# EAGLE schematic Electronics_Design_V2_v8 (EAGLE 9.7.0)
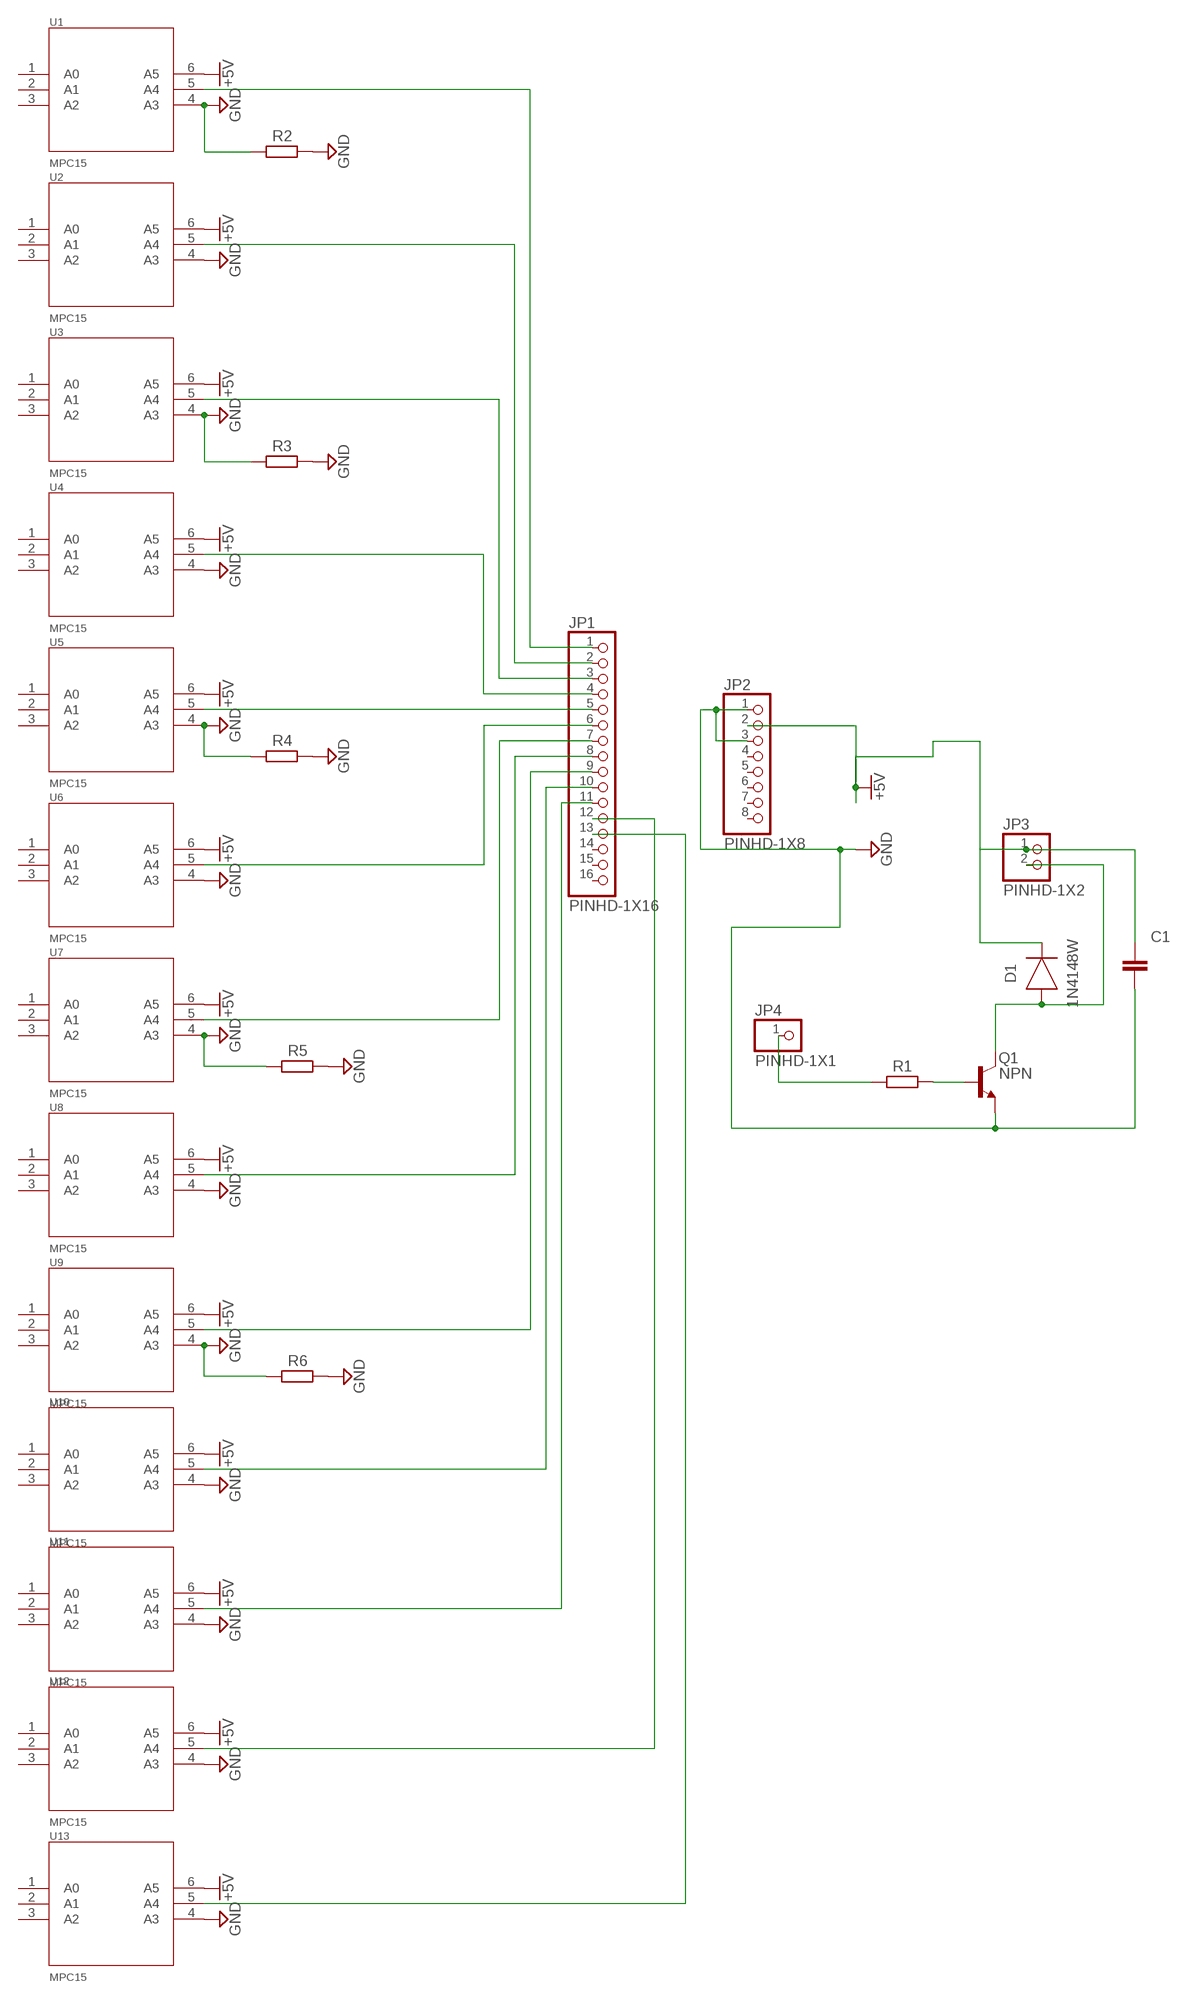
[diagram p0: schematic, sheet 1]

## Parts
C1  C_CHIP-1206(3216-METRIC)  [CAPC3216X135]
D1  1N4148W  DIODE_1N4148W-7-F_SOD123G  [SOD3715X135]
JP1  PINHD-1X16  [1X16]
JP2  PINHD-1X8  [1X08]
JP3  PINHD-1X2  [1X02]
JP4  PINHD-1X1  [1X01]
Q1  NPN  NPN_SC-59  [SC59]
R1  R_CHIP-1206(3216-METRIC)  [RESC3216X70]
R2  R_CHIP-1206(3216-METRIC)  [RESC3216X70]
R3  R_CHIP-1206(3216-METRIC)  [RESC3216X70]
R4  R_CHIP-1206(3216-METRIC)  [RESC3216X70]
R5  R_CHIP-1206(3216-METRIC)  [RESC3216X70]
R6  R_CHIP-1206(3216-METRIC)  [RESC3216X70]
U1  MPC15  [DIP1000W53P254L850H340Q6B]
U2  MPC15  [DIP1000W53P254L850H340Q6B]
U3  MPC15  [DIP1000W53P254L850H340Q6B]
U4  MPC15  [DIP1000W53P254L850H340Q6B]
U5  MPC15  [DIP1000W53P254L850H340Q6B]
U6  MPC15  [DIP1000W53P254L850H340Q6B]
U7  MPC15  [DIP1000W53P254L850H340Q6B]
U8  MPC15  [DIP1000W53P254L850H340Q6B]
U9  MPC15  [DIP1000W53P254L850H340Q6B]
U10  MPC15  [DIP1000W53P254L850H340Q6B]
U11  MPC15  [DIP1000W53P254L850H340Q6B]
U12  MPC15  [DIP1000W53P254L850H340Q6B]
U13  MPC15  [DIP1000W53P254L850H340Q6B]

## Nets
+5V: C1.1 D1.1(C) JP2.2 JP3.1 U1.6(A5) U2.6(A5) U3.6(A5) U4.6(A5) U5.6(A5) U6.6(A5) U7.6(A5) U8.6(A5) U9.6(A5) U10.6(A5) U11.6(A5) U12.6(A5) U13.6(A5)
GND: C1.2 JP2.1 JP2.3 Q1.E R2.1 R2.2 R3.1 R3.2 R4.1 R4.2 R5.1 R5.2 R6.1 R6.2 U1.4(A3) U2.4(A3) U3.4(A3) U4.4(A3) U5.4(A3) U6.4(A3) U7.4(A3) U8.4(A3) U9.4(A3) U10.4(A3) U11.4(A3) U12.4(A3) U13.4(A3)
N$1: JP1.1 U1.5(A4)
N$2: JP1.2 U2.5(A4)
N$3: JP1.3 U3.5(A4)
N$4: JP1.4 U4.5(A4)
N$5: JP1.5 U5.5(A4)
N$6: JP1.6 U6.5(A4)
N$7: JP1.7 U7.5(A4)
N$8: JP1.8 U8.5(A4)
N$9: JP1.9 U9.5(A4)
N$10: JP1.10 U10.5(A4)
N$11: JP1.11 U11.5(A4)
N$12: JP1.12 U12.5(A4)
N$13: JP1.13 U13.5(A4)
N$14: JP4.1 R1.1
N$15: Q1.B R1.2
N$17: D1.2(A) JP3.2 Q1.C
Unconnected: JP1.14 JP1.15 JP1.16 JP2.4 JP2.5 JP2.6 JP2.7 JP2.8 U1.1(A0) U1.2(A1) U1.3(A2) U2.1(A0) U2.2(A1) U2.3(A2) U3.1(A0) U3.2(A1) U3.3(A2) U4.1(A0) U4.2(A1) U4.3(A2) U5.1(A0) U5.2(A1) U5.3(A2) U6.1(A0) U6.2(A1) U6.3(A2) U7.1(A0) U7.2(A1) U7.3(A2) U8.1(A0) U8.2(A1) U8.3(A2) U9.1(A0) U9.2(A1) U9.3(A2) U10.1(A0) U10.2(A1) U10.3(A2) U11.1(A0) U11.2(A1) U11.3(A2) U12.1(A0) U12.2(A1) U12.3(A2) U13.1(A0) U13.2(A1) U13.3(A2)

## Library data of the parts
C1 = Capacitor:C: Capacitor - Generic; CATEGORY: Capacitor
D1 = Diode:DIODE_: Diode Rectifier - Popular parts; CATEGORY: Diode; DESCRIPTION: DIODE GEN PURP 100V 300MA SOD123; MANUFACTURER: Diodes Incorporated; SUB-CATEGORY: Rectifier
JP1 = Connector:PINHD-1X16: PIN HEADER; CATEGORY: CONNECTOR; SUB-CATEGORY: PIN-HEADER
JP2 = Connector:PINHD-1X8: PIN HEADER; CATEGORY: CONNECTOR; SUB-CATEGORY: PIN-HEADER
JP3 = Connector:PINHD-1X2: PIN HEADER; CATEGORY: CONNECTOR; SUB-CATEGORY: PIN-HEADER
JP4 = Connector:PINHD-1X1: PIN HEADER; CATEGORY: CONNECTOR; SUB-CATEGORY: PIN-HEADER
Q1 = Transistor:NPN: NPN - Generic; CATEGORY: Transistor; SUB-CATEGORY: BJT; TYPE: NPN
R1-R6 = Resistor:R: Resistor Fixed - Generic; CATEGORY: Resistor; SUB-CATEGORY: Fixed
U1-U13 = MPC15:MPC15